# EasyEDA Pro project _天猛星MSPM0电赛1.0_2025-07-10.epro, board PCB3
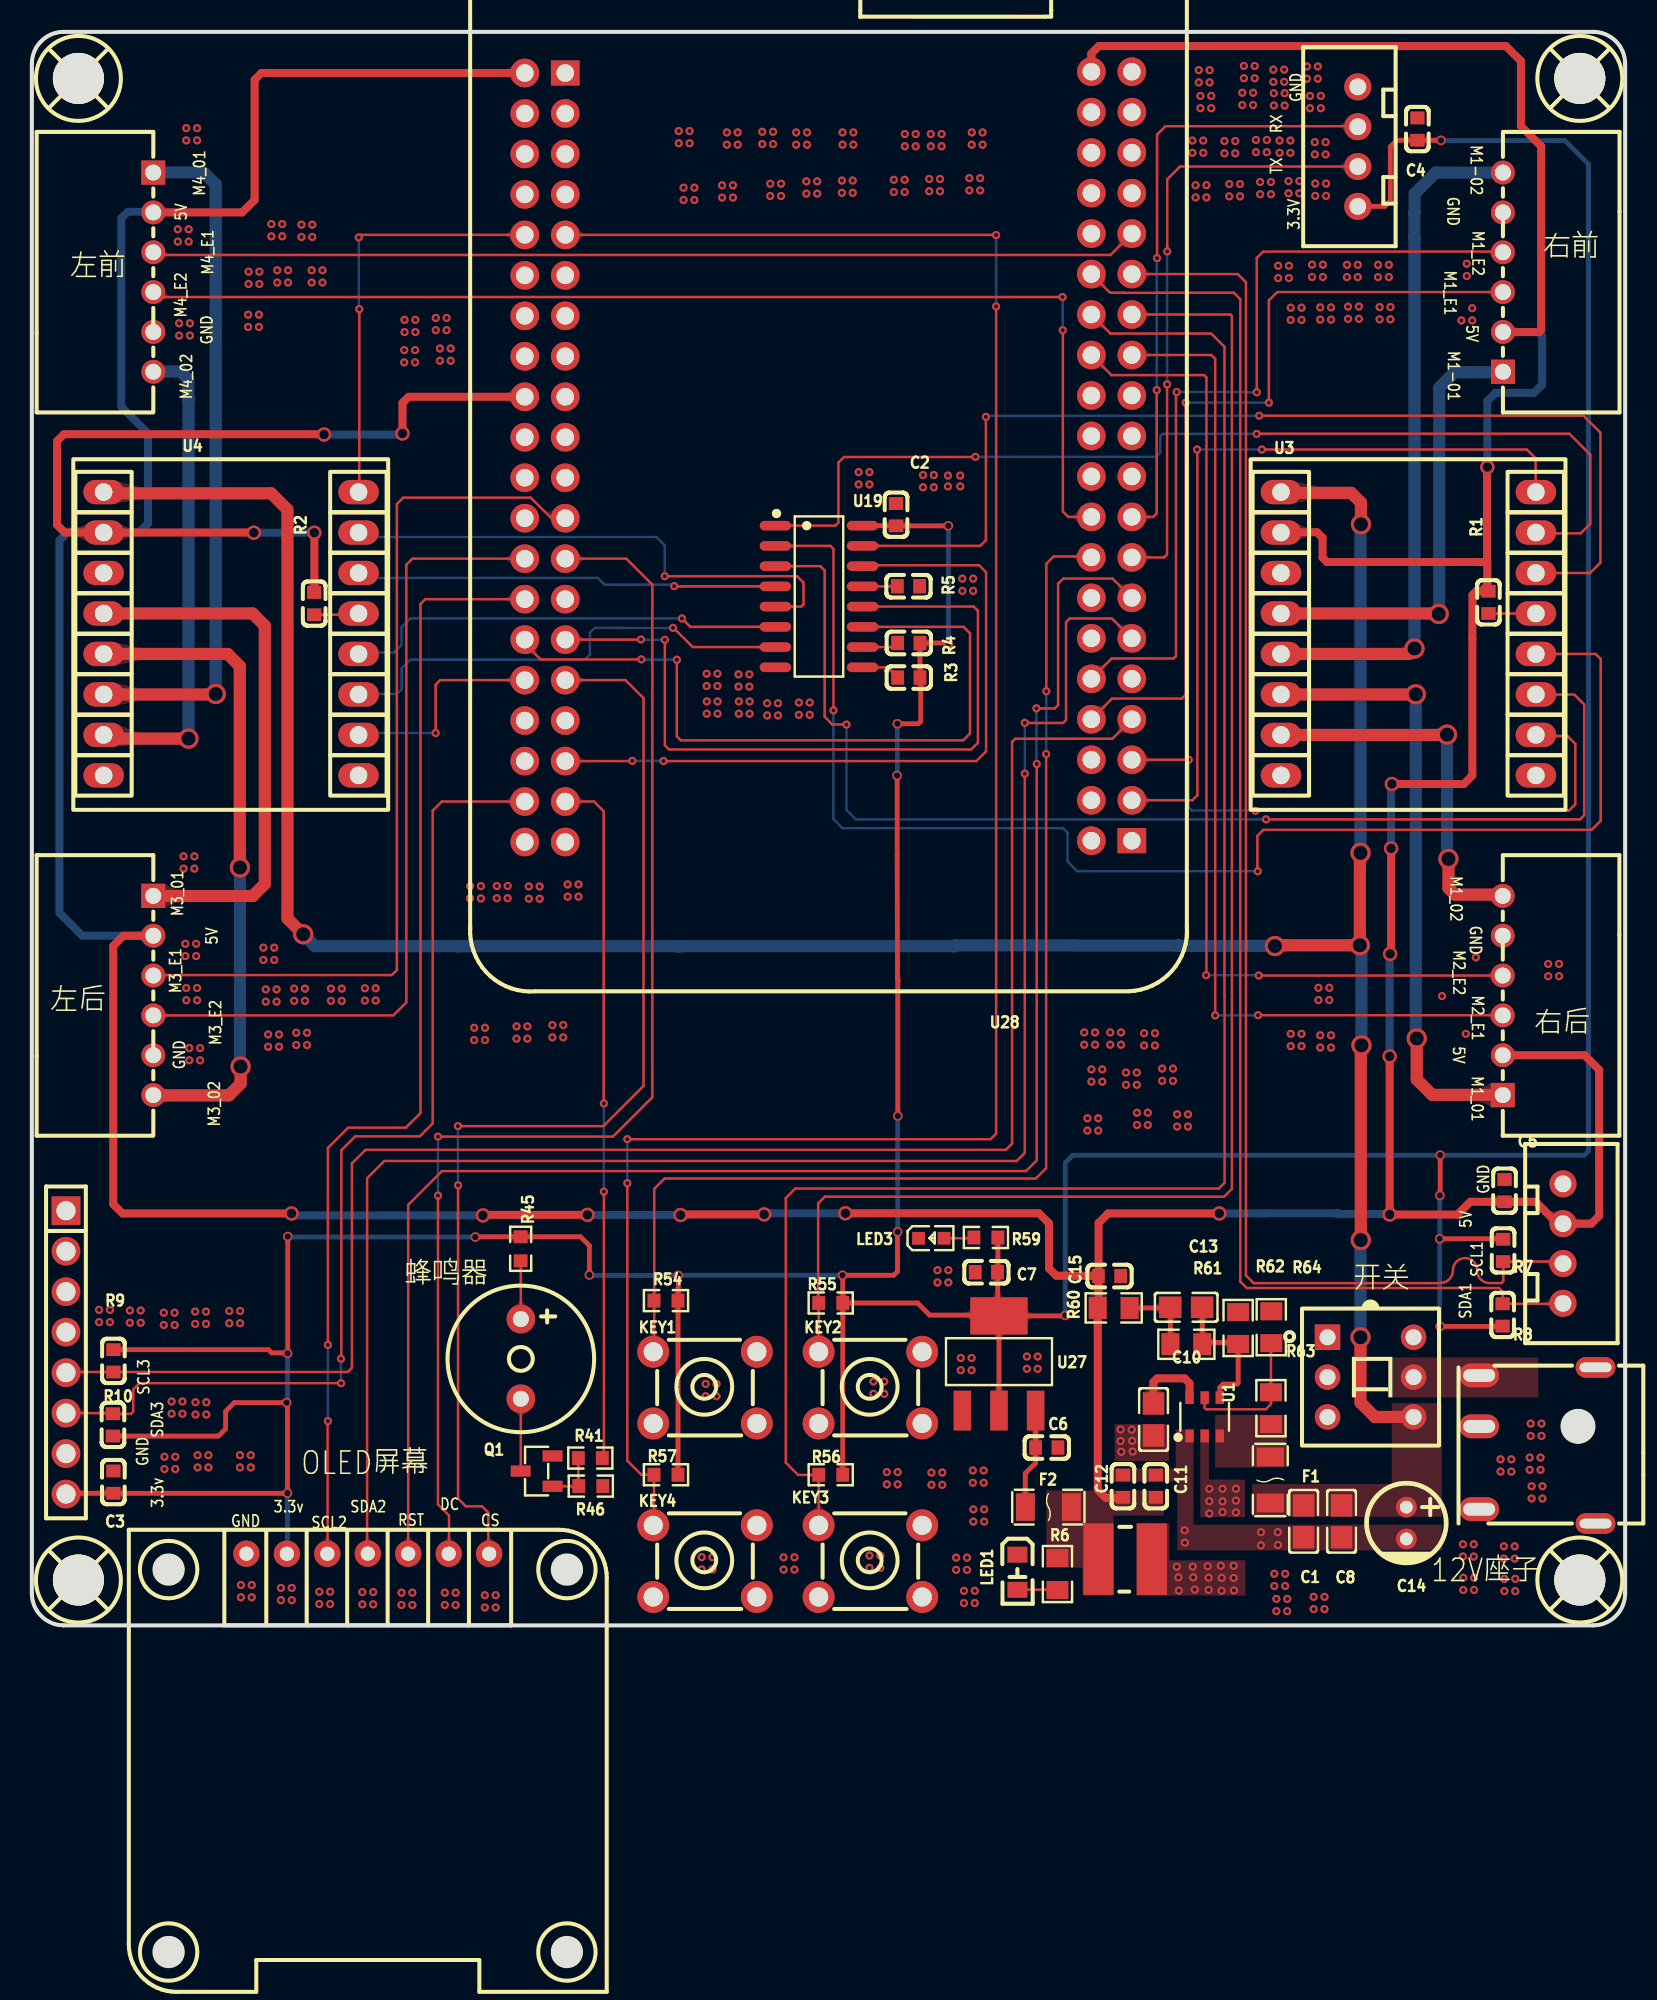
[diagram p3: board, top side]
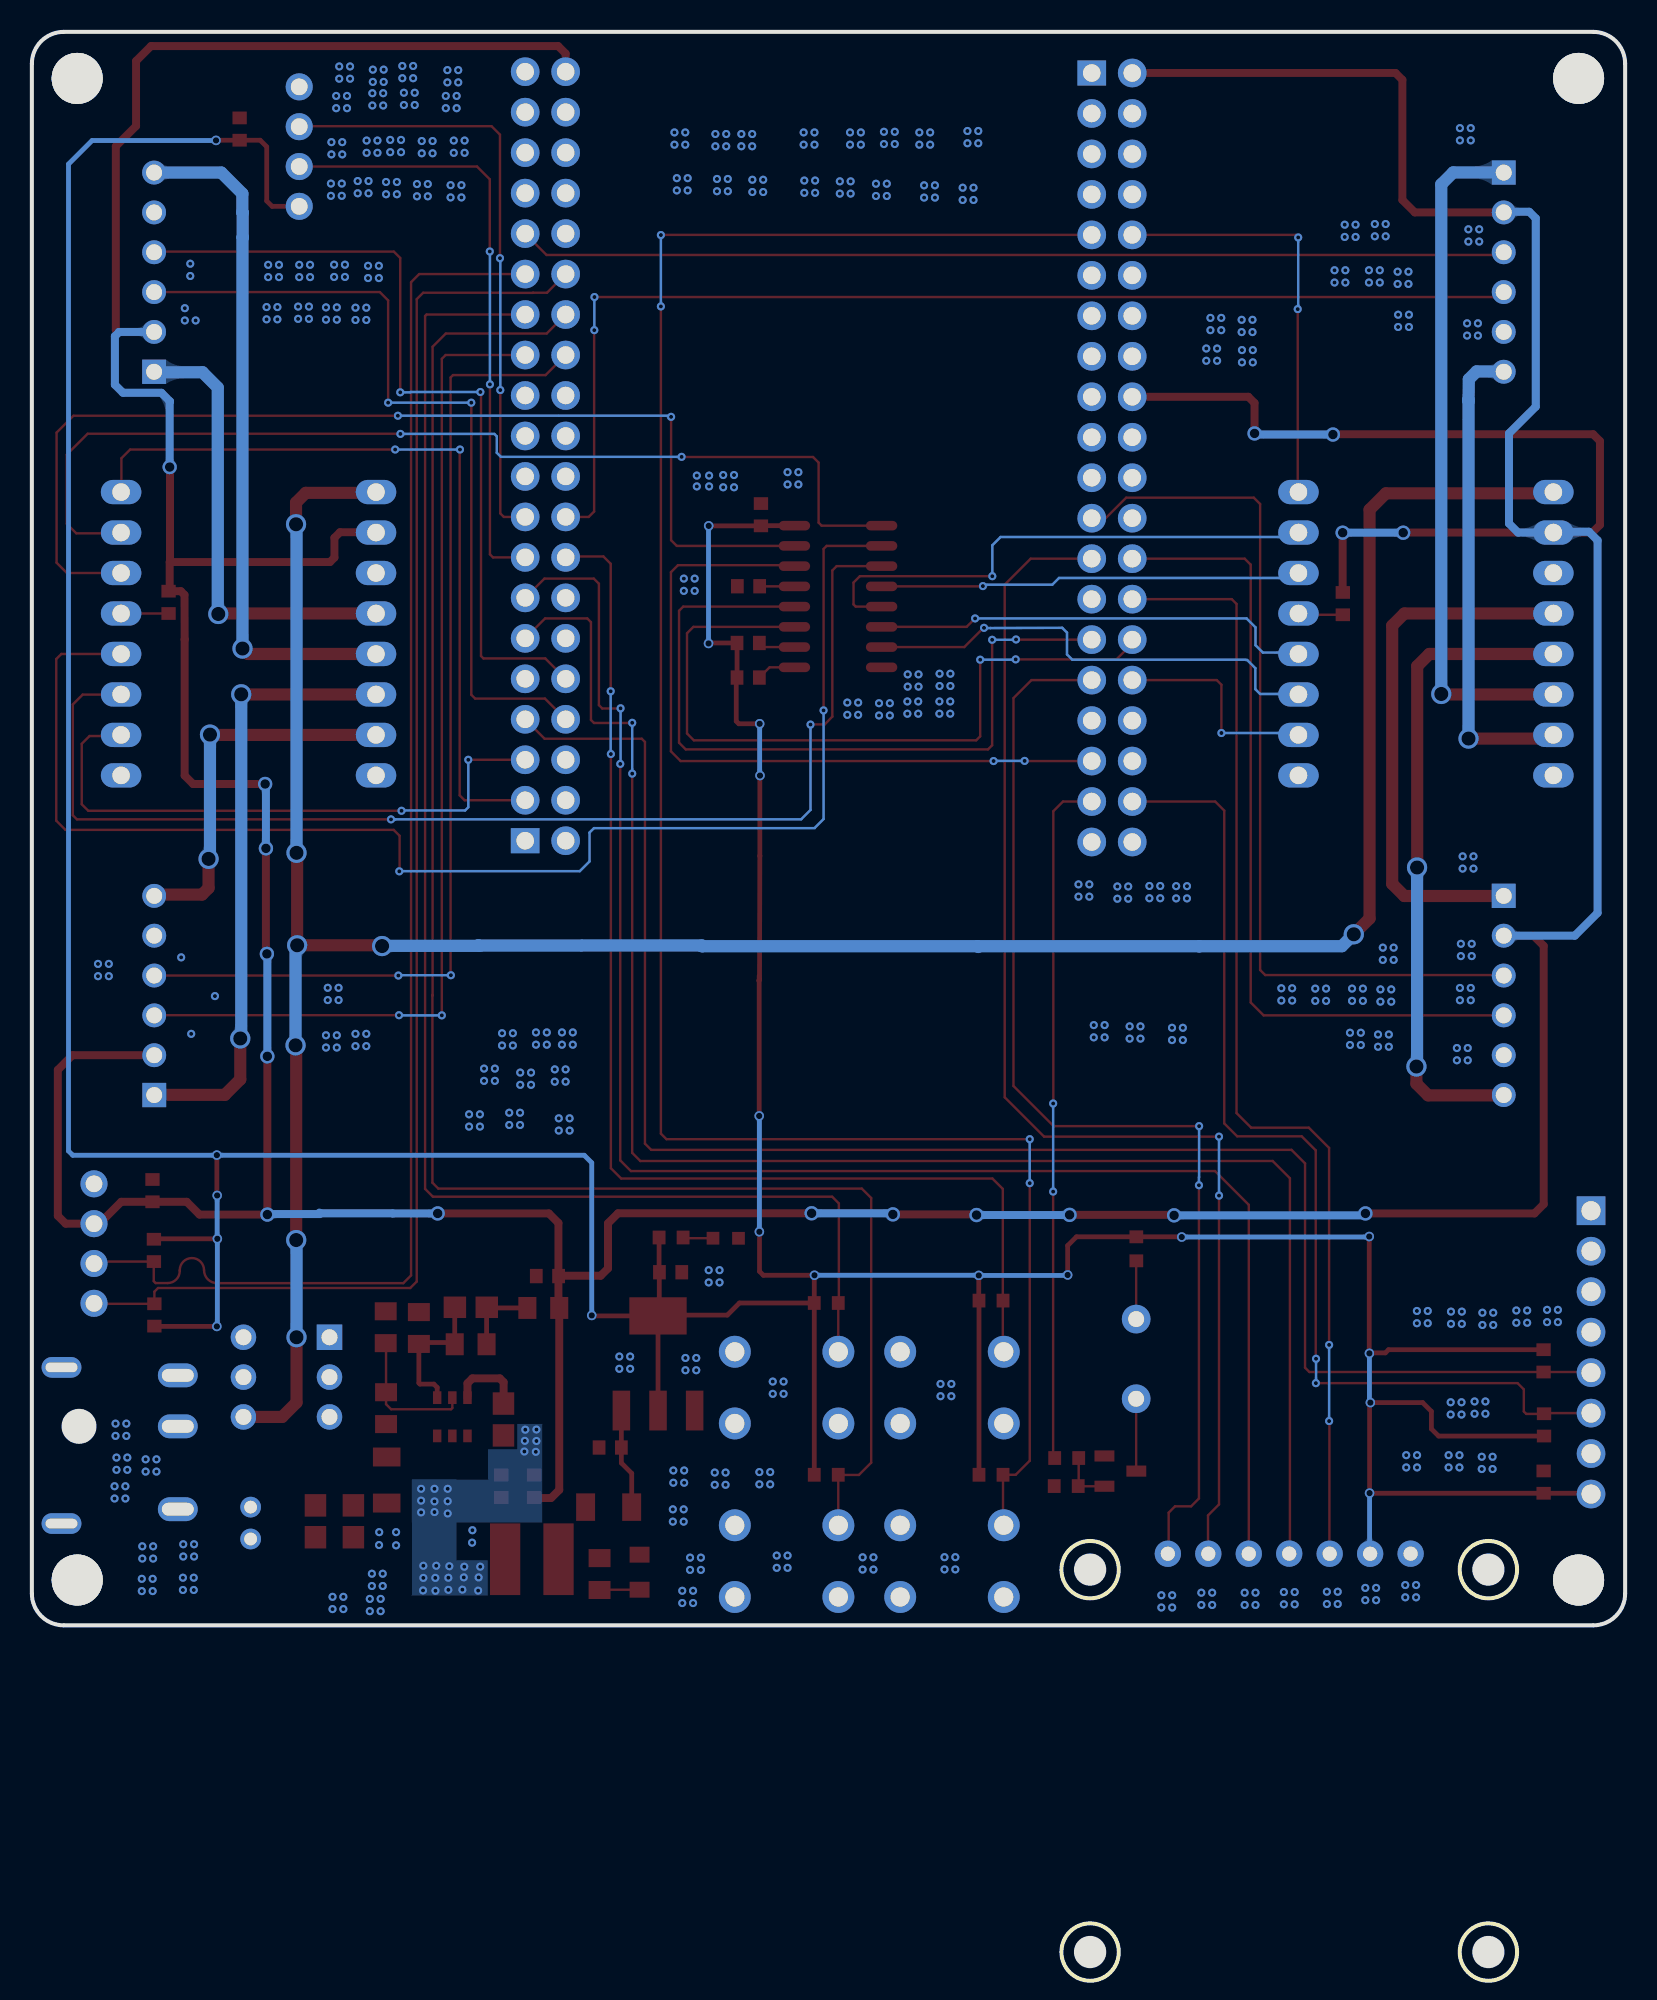
[diagram p4: board, bottom side, seen from below]

Outline 100 x 121.51 mm; copper layers: Top Layer, Bottom Layer. Coordinates in mm from the lower left corner of the outline.
Outline path: 0,119.51 0,23.51 arc(0.59,22.1) 2,21.51 98,21.51 arc(99.41,22.1) 100,23.51 100,119.51 arc(99.41,120.93) 98,121.51 2,121.51 arc(0.59,120.93) 0,119.51
Stack: Top Layer 0.035mm / Dielectric1 1.51mm FR4 er 4.5 / Bottom Layer 0.035mm

## Design rules (mm)
net +3.3V: 3.3v
net 5V: 5v
net SCL1: DP3
net SDA1: DP3
net 12V: 12v
net M2_O2: 12v
net M2_O1: 12v
net M1_O2: 12v
net M1_O1: 12v
net M4_O2: 12v
net M4_O1: 12v
net M3_O2: 12v
net M3_O1: 12v
net FB: 3.3v
net $1N22686: 3.3v
net $1N22679: 5v
net DC12V: 12v
net $1N2097: 3.3v
template: 常用
spacing copperThickness1oz (default): track to track 0.203, other pairs 0.152 to 0.203
spacing copperThickness2oz: track to track 0.203, other pairs 0.152 to 0.3
track width 12: min 0.762, default 0.762, max 0.762
track width 信号线 (default): min 0.152, default 0.152, max 0.152
track width 3v3: min 0.3, default 0.3, max 0.5
track width 5v电源线: min 0.5, default 0.5, max 1
differential pair differentialPair (default): width min 0.152, default 0.152, max 0.152; gap min 0.152, default 0.152
via 信号线孔 (default): diameter min 0.508, default 0.508, max 0.508; hole min 0.254, default 0.254, max 0.305
via 3v3: diameter min 0.4, default 0.6, max 1; hole min 0.4, default 0.4, max 0.6
via 12v: diameter min 0.762, default 1.27, max 2.032; hole min 0.762, default 0.889, max 2.032
via 5v: diameter min 0.75, default 0.9, max 2; hole min 0.6, default 0.6, max 2
net class 3.3v uses 3v3
net class 5v uses 5v, 5v电源线
net class 12v uses 12, 12v
net +3.3V uses 3v3
net 5V uses 5v, 5v电源线
net 12V uses 12, 12v
net M2_O2 uses 12, 12v
net M2_O1 uses 12, 12v
net M1_O2 uses 12, 12v
net M1_O1 uses 12, 12v
net M4_O2 uses 12, 12v
net M4_O1 uses 12, 12v
net M3_O2 uses 12, 12v
net M3_O1 uses 12, 12v
net FB uses 3v3
net $1N22686 uses 3v3
net $1N22679 uses 5v, 5v电源线
net DC12V uses 12, 12v
net $1N2097 uses 3v3

## Placement (name value [footprint] x y rotation side)
BUZZER3  3kHz  [BUZ-TH_BD9.0-P5.00-D0.6-FD]  30.69 38.23 270 top
C1  100nF  [C0805]  79.82 28.04 90 top
C2  100nF  [C0603]  54.24 91.21 90 top
C3  100nF  [C0603]  5.12 30.5 270 top
C4  100nF  [C0603]  86.96 115.41 90 top
C5  100nF  [C0603]  92.43 48.79 270 top
C6  100nF  [C0603]  63.7 32.67 180 top
C7  100nF  [C0603]  59.91 43.67 0 top
C8  10uF  [C0805]  82.2 28.04 90 top
C10  100nF  [C0805]  70.4 34.43 90 top
C11  0.1uF  [C0603]  70.54 30.24 270 top
C12  22uF  [C0603]  68.48 30.24 270 top
C13  75pf  [C0805]  72.45 41.47 180 top
C14  47uF  [CAP-TH_BD5.0-P2.00-D0.8-FD]  86.27 27.93 270 top
C15  22uF  [C0603]  67.64 43.43 180 top
DC1  HX DC044B-2.0 QT  [DC-IN-TH_HX-DC044B-2.0-QT]  94.49 32.8 180 top
F1  nSMD010  [F1206]  77.73 30.63 90 top
F2  nSMD010  [F1206]  63.8 28.93 180 top
H1  -  [HDR-TH_8P-P2.54-V-F-1]  2.14 38.64 270 top
KEY1  按键开关6*6*8  [KEY-TH_4P-L6.0-W6.0-P4.50-LS7.5]  42.25 36.43 0 top
KEY2  按键开关6*6*8  [KEY-TH_4P-L6.0-W6.0-P4.50-LS7.5]  52.63 36.43 0 top
KEY3  按键开关6*6*8  [KEY-TH_4P-L6.0-W6.0-P4.50-LS7.5]  52.63 25.54 0 top
KEY4  按键开关6*6*8  [KEY-TH_4P-L6.0-W6.0-P4.50-LS7.5]  42.25 25.54 0 top
LED1  -  [LED_0805]  61.85 24.8 270 top
LED3  -  [LED_0603]  56.5 45.81 0 top
Q1  AO3400A  [SOT-23-3_L2.9-W1.3-P1.90-LS2.4-BR]  31.68 31.19 0 top
R1  10K  [C0603]  91.42 85.71 90 top
R2  10K  [C0603]  17.72 85.63 90 top
R3  10K  [C0603]  55.04 80.99 0 top
R4  10K  [C0603]  55.04 83.16 0 top
R5  10K  [C0603]  55.02 86.72 0 top
R6  5K  [R0805]  64.37 24.73 90 top
R7  4.7K  [C0603]  92.34 45.04 270 top
R8  4.7K  [C0603]  92.31 40.99 90 top
R9  4.7K  [C0603]  5.12 38.11 270 top
R10  4.7K  [C0603]  5.09 34.09 90 top
R41  22R  [R0603]  35.05 32.01 0 top
R45  100R  [R0603]  30.68 45.14 270 top
R46  10K  [R0603]  35.08 30.25 180 top
R54  10K  [R0603]  39.8 41.89 180 top
R55  10K  [R0603]  50.14 41.74 180 top
R56  10K  [R0603]  50.14 30.96 180 top
R57  10K  [R0603]  39.8 30.96 180 top
R59  2k  [R0603]  59.88 45.85 0 top
R60  49.9  [R0805]  67.9 41.43 180 top
R61  100K  [R0805]  72.46 39.15 180 top
R62  13.3K  [R0805]  75.71 40.17 270 top
R63  511K  [R0805]  77.77 35.14 270 top
R64  105K  [R0805]  77.79 40.22 270 top
SCREW1  -  [M3螺丝]  97.16 118.59 0 top
SCREW2  -  [M3螺丝]  2.92 24.36 0 top
SCREW3  -  [M3螺丝]  2.92 118.59 0 top
SCREW4  -  [M3螺丝]  97.16 24.36 0 top
SW1  XKB8585-Z-150  [SW-TH_6P-L8.5-W8.5-P2.50-LS5.4-BL-1]  84.02 37.09 270 top
U1  TPS54302DDCT  [TSOT-23-6_L2.9-W1.6-P0.95-LS2.8-BR]  73.61 34.6 270 top
U3  -  [TB6612]  76.34 72.64 0 top
U4  -  [TB6612]  2.45 72.64 0 top
U11  OLED_SPI  [0.96OLED_7P]  21.08 26.01 0 top
U18  PCA9555  [CONN-TH_4P-P2.50-XH2.54-4P]  96.1 45.47 90 top
U19  74HC595D,118  [SOIC-16_L9.9-W3.9-P1.27-LS6.0-BL]  49.4 86.08 270 top
U21  UART1  [CONN-TH_4P-P2.50-XH2.54-4P]  83.22 114.31 270 top
U27  A1117-3.3  [SOT-223-3_L6.5-W3.4-P2.30-LS7.0-BR-1]  60.7 37.96 270 top
U28  LCKFB-TMX-MSPM0G3507  [COMM-TH_LCKFB-TMX-MSPM0G3507]  49.99 94.84 180 top
U29  ZX-XH2.54-6PWZ  [CONN-TH_6P-P2.50_ZX-XH2.54-6PWZ]  92.33 106.43 90 top
U30  ZX-XH2.54-6PWZ  [CONN-TH_6P-P2.50_ZX-XH2.54-6PWZ]  92.32 61.04 90 top
U31  ZX-XH2.54-6PWZ  [CONN-TH_6P-P2.50_ZX-XH2.54-6PWZ]  7.62 61.04 270 top
U32  ZX-XH2.54-6PWZ  [CONN-TH_6P-P2.50_ZX-XH2.54-6PWZ]  7.62 106.43 270 top
U33  10uh  [IND-SMD_L4.5-W4.0_SCD0403T]  68.62 25.66 180 top

## Footprints (pads in the part's own frame, mm; a bottom-side part is the same pattern mirrored in y, then rotated)
0.96OLED_7P
  round 1.651 hole 0.889: 1(-7.617,0.003) 2(-5.077,-0.003) 3(-2.538,-0.003) 4(0.003,0.005) 5(2.54,0) 6(5.08,0) 7(7.62,-0.003)
BUZ-TH_BD9.0-P5.00-D0.6-FD
  round 1.8 hole 1: 1(-2.5,0) 2(2.5,0)
C0603
  rect 0.8x0.9 smd: 1(-0.7,0) 2(0.7,0)
C0805
  rect 1.41x1.35 smd: 1(-1,0) 2(1,0)
CAP-TH_BD5.0-P2.00-D0.8-FD
  round 1.3 hole 0.8: 1(-1,0) 2(1,0)
COMM-TH_LCKFB-TMX-MSPM0G3507
  rect 1.8x1.575 hole 1.1: 1(-19.05,24.09) 41(16.51,-24.09)
  round 1.8 hole 1.1: 2(-16.51,24.09) 3(-19.05,21.549) 4(-16.51,21.549) 5(-19.05,19.009) 6(-16.51,19.009) 7(-19.05,16.47) 8(-16.51,16.47) 9(-19.05,13.93) 10(-16.51,13.93) 11(-19.05,11.389) 12(-16.51,11.389) 13(-19.05,8.85) 14(-16.51,8.85) 15(-19.05,6.309) 16(-16.51,6.309) 17(-19.05,3.769) 18(-16.51,3.769) 19(-19.05,1.23) 20(-16.51,1.23) 21(-19.05,-1.31) 22(-16.51,-1.31) 23(-19.05,-3.85) 24(-16.51,-3.85) 25(-19.05,-6.391) 26(-16.51,-6.391) 27(-19.05,-8.931) 28(-16.51,-8.931) 29(-19.05,-11.47) 30(-16.51,-11.47) 31(-19.05,-14.011) 32(-16.51,-14.011) 33(-19.05,-16.55) 34(-16.51,-16.55) 35(-19.05,-19.09) 36(-16.51,-19.09) 37(-19.05,-21.631) 38(-16.51,-21.631) 39(-19.05,-24.171) 40(-16.51,-24.171) 42(19.05,-24.09) 43(16.51,-21.549) 44(19.05,-21.549) 45(16.51,-19.009) 46(19.05,-19.009) 47(16.51,-16.47) 48(19.05,-16.47) 49(16.51,-13.93) 50(19.05,-13.93) 51(16.51,-11.389) 52(19.05,-11.389) 53(16.51,-8.85) 54(19.05,-8.85) 55(16.51,-6.309) 56(19.05,-6.309) 57(16.51,-3.769) 58(19.05,-3.769) 59(16.51,-1.23) 60(19.05,-1.23) 61(16.51,1.31) 62(19.05,1.31) 63(16.51,3.85) 64(19.05,3.85) 65(16.51,6.391) 66(19.05,6.391) 67(16.51,8.931) 68(19.05,8.931) 69(16.51,11.47) 70(19.05,11.47) 71(16.51,14.011) 72(19.05,14.011) 73(16.51,16.55) 74(19.05,16.55) 75(16.51,19.09) 76(19.05,19.09) 77(16.51,21.631) 78(19.05,21.631) 79(16.51,24.171) 80(19.05,24.171)
CONN-TH_4P-P2.50-XH2.54-4P
  round 1.7 hole 1.05: 1(3.75,0) 2(1.25,0) 3(-1.25,0) 4(-3.75,0)
CONN-TH_6P-P2.50_ZX-XH2.54-6PWZ
  rect 1.524x1.5 hole 1: 1(-6.25,0)
  round 1.5 hole 1: 2(-3.75,0) 3(-1.25,0) 4(1.25,0) 5(3.75,0) 6(6.25,0)
DC-IN-TH_HX-DC044B-2.0-QT
  oval 2.5x1.3 hole 2x0.6: 1(-3.65,4.9) 1(-3.65,-4.9)
  oval 2.5x1.5 hole 2x0.8: 2(3.65,4) 3(3.65,-1.2) 4(3.65,-4.4)
F1206
  rect 1.19x1.728 smd: 1(-1.445,0) 2(1.445,0)
HDR-TH_8P-P2.54-V-F-1
  rect 1.8x1.8 hole 1.2: 1(-8.89,0)
  round 1.8 hole 1.2: 2(-6.35,0) 3(-3.81,0) 4(-1.27,0) 5(1.27,0) 6(3.81,0) 7(6.35,0) 8(8.89,0)
IND-SMD_L4.5-W4.0_SCD0403T
  rect 1.9x4.5 smd: 1(-1.675,0) 2(1.675,0)
KEY-TH_4P-L6.0-W6.0-P4.50-LS7.5
  round 2 hole 1.2: 1(-3.25,-2.25) 2(3.25,-2.25) 3(3.25,2.25) 4(-3.25,2.25)
LED_0603
  rect 0.8x0.8 smd: 1(-0.851,-0.01) 2(0.75,-0.005)
LED_0805
  rect 1x1.25 smd: 1(-1.15,0.005) 2(1.05,0.005)
M3螺丝
  round 3.2 hole 3.2: 1(0,0)
R0603
  rect 0.806x0.864 smd: 1(-0.753,0) 2(0.753,0)
R0805
  rect 1.133x1.377 smd: 1(-1,0) 2(1,0)
SOIC-16_L9.9-W3.9-P1.27-LS6.0-BL
  oval 0.602x1.971 smd: 1(-4.445,-2.736) 2(-3.175,-2.736) 3(-1.905,-2.736) 4(-0.635,-2.736) 5(0.635,-2.736) 6(1.905,-2.736) 7(3.175,-2.736) 8(4.445,-2.736) 9(4.445,2.736) 10(3.175,2.736) 11(1.905,2.736) 12(0.635,2.736) 13(-0.635,2.736) 14(-1.905,2.736) 15(-3.175,2.736) 16(-4.445,2.736)
SOT-23-3_L2.9-W1.3-P1.90-LS2.4-BR
  rect 1.25x0.7 smd: 1(1,-0.95) 2(1,0.95) 3(-1,0)
SOT-223-3_L6.5-W3.4-P2.30-LS7.0-BR-1
  rect 2.5x1.1 smd: 1(2.97,-2.3) 2(2.97,0) 3(2.97,2.3)
  rect 2.34x3.6 smd: 2(-2.97,0)
SW-TH_6P-L8.5-W8.5-P2.50-LS5.4-BL-1
  rect 1.6x1.6 hole 1: 1(-2.5,-2.7)
  round 1.6 hole 1: 2(0,-2.7) 3(2.5,-2.7) 4(2.5,2.7) 5(0.001,2.7) 6(-2.5,2.7)
TB6612
  oval 2.54x1.524 hole 1.1: 1(2.057,19.988) 2(2.057,17.448) 3(2.057,14.908) 4(2.057,12.368) 5(2.057,9.828) 6(2.057,7.288) 7(2.057,4.748) 8(2.057,2.208) 9(18.057,2.208) 10(18.057,4.748) 11(18.057,7.288) 12(18.057,9.828) 13(18.057,12.368) 14(18.057,14.908) 15(18.057,17.448) 16(18.057,19.988)
TSOT-23-6_L2.9-W1.6-P0.95-LS2.8-BR
  rect 0.8x0.532 smd: 1(1.2,-0.95) 2(1.2,0) 3(1.2,0.95) 4(-1.2,0.95) 5(-1.2,0) 6(-1.2,-0.95)

## Nets
As in the schematic.

Pads without a net: H1 1 2 3 4; KEY1 2 3; KEY2 2 3; KEY3 2 3; KEY4 2 3; SCREW1 1; SCREW2 1; SCREW3 1; SCREW4 1; SW1 1 2 3 6; U28 1 4 6 9 12 14 19 20 21 22 23 24 32 33 34 35 36 38 41 43 44 45 46 47 48 51 52 53 54 55 56 57 59 60 61 62 64 67 73 74 76

## Via types
v1: diameter 0.508, hole 0.254, Top Layer to Bottom Layer, 655 vias
v2: diameter 0.6, hole 0.4, Top Layer to Bottom Layer, 20 vias
v3: diameter 0.9, hole 0.6, Top Layer to Bottom Layer, 17 vias
v4: diameter 1.27, hole 0.889, Top Layer to Bottom Layer, 18 vias

## Routing (per net, layer and track width the routed paths; a pad name or vN(x,y) marks a point on that pad's centre or on a via; arc(x,y) is an arc through that point)
5V: length 427
  Top Layer w0.5: 90.41,83.38 90.41,83.39 ; 90.41,83.38 90.42,86.18 90.65,86.41 91.35,86.41 ; 90.41,83.38 90.41,74.84 89.88,74.31 v3(85.36,74.31) ; 66.95,43.45 66.95,46.76 67.55,47.36 v3(74.53,47.36) ; 66.95,43.45 64.3,43.45 63.84,43.91 63.84,46.74 63.21,47.37 v3(51.06,47.37) ; 66.95,43.45 66.95,41.48 R60.2 66.9,30.01 67.39,29.52 ; U30.2 97.45,57.29 98.37,56.37 98.37,47.21 97.88,46.72 U18.2 95.76,46.72 94.39,48.09 C5.2 90.28,48.09 89.48,47.29 v3(85.22,47.29) v3(85.22,57.22) ; v3(28.31,47.24) 28.34,47.27 v3(34.87,47.27) ; U29.2 92.34,102.67 94.6,102.67 94.73,102.8 94.73,114.33 93.46,115.6 93.46,119.68 92.52,120.62 66.97,120.62 66.5,120.15 U28.40 ; v3(40.71,47.26) 40.75,47.3 v3(45.96,47.3) ; U32.2 13.2,110.18 13.98,110.96 13.98,118.5 14.41,118.93 U28.42 ; 91.33,88.24 91.33,94.18 v3(91.35,94.2) ; 91.33,88.24 91.35,88.24 91.35,86.41 ; 91.33,88.24 91.33,88.16 ; 91.33,88.24 81.29,88.24 81.01,88.52 81.01,89.76 80.66,90.11 78.42,90.11 U3.2 ; v3(23.26,96.31) 23.26,98.22 23.65,98.61 U28.58 ; v3(16.3,47.36) 5.69,47.36 5.11,47.94 5.11,64.15 5.75,64.79 U31.2 ; 91.35,86.41 R1.2 ; v3(18.34,96.24) 18.32,96.26 2.01,96.26 1.58,95.83 1.58,90.57 2.06,90.09 U4.2 13.92,90.09 v3(13.93,90.08) ; v3(85.25,63.65) 85.31,63.71 v3(85.31,70.27) ; R2.2 17.73,86.34 v3(17.73,90.08) ; C12.2 68.44,29.5 67.42,29.5
  Bottom Layer w0.5: v3(51.06,47.37) 46.03,47.37 v3(45.96,47.3) ; v3(18.34,96.24) 23.19,96.24 v3(23.26,96.31) ; v3(40.71,47.26) 34.84,47.26 34.82,47.24 ; U32.2 7.58,110.22 6.02,110.22 5.61,109.81 5.61,97.99 7.29,96.31 7.29,90.66 6.72,90.09 U4.2 4.45,90.14 2.27,90.14 1.73,89.6 1.73,66.22 3.16,64.79 U31.2 ; v3(28.31,47.24) 16.42,47.24 v3(16.3,47.36) ; 81.95,47.41 81.91,47.37 77.44,47.37 ; v3(85.31,70.27) 85.31,74.26 v3(85.36,74.31) ; v3(85.22,57.22) 85.22,63.62 v3(85.25,63.65) ; 77.34,47.35 77.33,47.36 v3(74.53,47.36) ; 81.91,47.32 85.19,47.32 v3(85.22,47.29) ; v3(13.93,90.08) v3(17.73,90.08) ; v3(91.35,94.2) 91.35,98.3 91.33,98.32 91.87,98.86 94.28,98.86 94.79,99.37 94.79,102.41 94.52,102.68 U29.2
12V: length 171.5
  Top Layer w0.762: v4(83.42,90.61) 83.42,91.97 82.81,92.58 78.45,92.58 U3.1 ; v4(83.39,69.99) 83.35,69.95 v4(83.35,64.19) 78.07,64.19 v4(78.02,64.14) ; SW1.4 84.29,34.59 83.39,35.49 v4(83.39,39.59) ; v4(83.45,57.91) 83.41,57.87 v4(83.41,45.69) ; U4.1 4.58,92.55 15.02,92.55 16.04,91.53 16.04,65.87 v4(17.03,64.88)
  Bottom Layer w0.762: v4(78.02,64.14) 78.01,64.15 71.88,64.15 ; 57.9,64.13 40.65,64.13 ; 57.9,64.13 57.95,64.18 65.47,64.18 ; 57.9,64.13 57.98,64.13 ; 40.65,64.13 26.74,64.13 ; 40.65,64.13 40.6,64.08 ; 26.74,64.13 17.78,64.13 v4(17.03,64.88) ; 26.74,64.13 26.72,64.11 ; v4(83.41,45.69) 83.39,45.67 v4(83.39,39.59) ; 71.98,64.2 71.95,64.17 65.52,64.17 ; v4(83.45,57.91) 83.45,64.09 v4(83.35,64.19) ; v4(83.39,69.99) 83.39,90.58 v4(83.42,90.61)
+3.3V: length 346.1
  Top Layer w0.3: v2(64.86,40.96) 64.83,40.93 U27.2 ; 54.31,69.8 54.31,74.83 v2(54.3,74.84) ; 54.31,69.8 54.31,69.78 ; 54.31,69.8 54.33,62.02 54.35,62 ; 54.35,62 54.38,61.97 ; 54.35,62 54.35,62.27 ; 54.35,62 v2(54.35,53.48) ; v2(34.99,43.5) 34.99,45.34 34.44,45.89 R45.1 27.84,45.89 v2(27.83,45.88) ; H1.8 2.19,29.8 C3.2 16.03,29.8 v2(16.04,29.81) 16.04,35.44 v2(15.99,35.49) 12.71,35.49 12.16,34.94 12.16,33.84 11.71,33.39 R10.1 ; R55.1 55.59,41.74 56.35,40.98 60.65,40.98 ; R55.1 50.89,43.47 v2(50.88,43.48) 54.09,43.48 54.33,43.72 54.33,46.2 v2(54.34,46.21) ; R55.1 R56.1 ; 57.57,90.49 57.55,90.51 v2(57.52,90.51) C2.1 54.23,90.52 U19.16 ; R7.1 92.31,45.77 v2(88.36,45.77) ; 60.62,43.81 60.62,43.68 ; 60.62,43.68 60.63,43.69 60.63,45.85 ; 60.62,43.68 60.62,41.01 60.65,40.98 ; 60.62,43.68 C7.2 ; v2(54.32,78.09) 55.63,78.09 55.79,78.25 55.79,80.94 R3.2 R4.2 57.5,83.16 v2(57.53,83.13) ; U27.2 60.65,40.98 ; U27.2 U27.2 ; U21.1 84.92,110.56 85.26,110.9 85.26,114.3 85.67,114.71 C4.1 88.43,114.71 ; R57.1 R54.1 40.57,41.91 v2(40.57,43.47) ; v2(88.39,40.27) 92.29,40.27 R8.1 ; v2(88.37,48.49) 88.39,48.51 v2(88.39,51.02) ; v2(16.06,45.91) 16.06,38.59 v2(16.05,38.58) 16.02,38.61 15.05,38.61 14.85,38.81 R9.1
  Bottom Layer w0.3: v2(54.35,53.48) 54.34,53.47 v2(54.34,46.21) ; v2(34.99,43.5) 35.02,43.47 v2(40.57,43.47) 40.58,43.48 v2(50.88,43.48) ; v2(16.05,38.58) 16.05,35.55 v2(15.99,35.49) ; v2(54.32,78.09) 54.32,74.86 v2(54.3,74.84) ; v2(27.83,45.88) 16.09,45.88 v2(16.06,45.91) ; v2(88.39,40.27) 88.36,40.3 v2(88.36,45.77) 88.37,45.78 v2(88.37,48.49) ; v2(57.53,83.13) 57.53,90.5 v2(57.52,90.51) ; U11.2 16.04,26.04 v2(16.04,29.81) ; 88.45,114.69 96.22,114.69 97.7,113.21 97.7,51.28 97.43,51.01 65.33,51.01 64.86,50.54 v2(64.86,40.96)
  vias: v2(88.44,114.7)
GND:
  vias: v1(4.22,41.31) v1(4.22,40.54) v1(4.9,41.31) v1(4.9,40.54) v1(6.15,41.27) v1(6.15,40.5) v1(6.83,41.27) v1(6.83,40.5) v1(8.28,41.13) v1(8.28,40.36) v1(8.32,32.09) v1(8.32,31.32) v1(8.77,35.56) v1(8.77,34.79) v1(8.96,41.13) v1(8.96,40.36) v1(9,32.09) v1(9,31.32) v1(9.16,109.12) v1(9.16,108.35) v1(9.24,103.22) v1(9.24,102.45) v1(9.52,69.77) v1(9.52,69) v1(9.45,35.56) v1(9.45,34.79) v1(9.63,64.28) v1(9.63,63.51) v1(9.69,115.47) v1(9.69,114.7) v1(9.69,61.51) v1(9.69,60.74) v1(9.84,109.12) v1(9.84,108.35) v1(9.92,103.22) v1(9.92,102.45) v1(9.88,57.74) v1(9.88,56.97) v1(10.2,69.77) v1(10.2,69) v1(10.25,41.2) v1(10.25,40.43) v1(10.31,64.28) v1(10.31,63.51) v1(10.27,35.51) v1(10.27,34.74) v1(10.37,115.47) v1(10.37,114.7) v1(10.37,61.51) v1(10.37,60.74) v1(10.4,32.19) v1(10.4,31.42) v1(10.56,57.74) v1(10.56,56.97) v1(10.93,41.2) v1(10.93,40.43) v1(10.95,35.51) v1(10.95,34.74) v1(11.08,32.19) v1(11.08,31.42) v1(12.39,41.24) v1(12.39,40.47) v1(13.07,41.24) v1(13.07,40.47) v1(13.06,32.19) v1(13.06,31.42) v1(13.12,24.04) v1(13.12,23.27) v1(13.6,106.46) v1(13.6,105.69) v1(13.57,103.76) v1(13.57,102.99) v1(13.74,32.19) v1(13.74,31.42) v1(13.8,24.04) v1(13.8,23.27) v1(14.25,103.76) v1(14.25,102.99) v1(14.28,106.46) v1(14.28,105.69) v1(14.53,64.04) v1(14.53,63.27) v1(14.68,61.42) v1(14.68,60.65) v1(14.83,58.59) v1(14.83,57.82) v1(15.03,109.45) v1(15.03,108.68) v1(15.21,64.04) v1(15.21,63.27) v1(15.4,106.55) v1(15.4,105.78) v1(15.36,61.42) v1(15.36,60.65) v1(15.51,58.59) v1(15.51,57.82) v1(15.63,23.86) v1(15.63,23.09) v1(15.71,109.45) v1(15.71,108.68) v1(16.08,106.55) v1(16.08,105.78) v1(16.31,23.86) v1(16.31,23.09) v1(16.46,61.47) v1(16.46,60.7) v1(16.59,58.7) v1(16.59,57.93) v1(16.92,109.41) v1(16.92,108.64) v1(17.14,61.47) v1(17.14,60.7) v1(17.27,58.7) v1(17.27,57.93) v1(17.6,109.41) v1(17.6,108.64) v1(17.56,106.55) v1(17.56,105.78) v1(18.04,23.62) v1(18.04,22.85) v1(18.24,106.55) v1(18.24,105.78) v1(18.72,23.62) v1(18.72,22.85) v1(18.77,61.47) v1(18.77,60.7) v1(19.45,61.47) v1(19.45,60.7) v1(20.74,23.6) v1(20.74,22.83) v1(20.9,61.49) v1(20.9,60.72) v1(21.42,23.6) v1(21.42,22.83) v1(21.58,61.49) v1(21.58,60.72) v1(23.2,23.56) v1(23.2,22.79) v1(23.39,103.44) v1(23.39,102.67) v1(23.37,101.54) v1(23.37,100.77) v1(23.88,23.56) v1(23.88,22.79) v1(24.05,101.54) v1(24.05,100.77) v1(24.07,103.44) v1(24.07,102.67) v1(25.35,103.56) v1(25.35,102.79) v1(25.61,101.64) v1(25.61,100.87) v1(25.92,23.56) v1(25.92,22.79) v1(26.03,103.56) v1(26.03,102.79) v1(26.29,101.64) v1(26.29,100.87) v1(26.6,23.56) v1(26.6,22.79) v1(27.5,67.9) v1(27.5,67.13) v1(27.76,59.01) v1(27.76,58.24) v1(28.18,67.9) v1(28.18,67.13) v1(28.44,59.01) v1(28.44,58.24) v1(28.43,23.4) v1(28.43,22.63) v1(29.11,23.4) v1(29.11,22.63) v1(29.18,67.91) v1(29.18,67.14) v1(29.86,67.91) v1(29.86,67.14) v1(30.42,59.1) v1(30.42,58.33) v1(31.1,59.1) v1(31.1,58.33) v1(31.19,67.88) v1(31.19,67.11) v1(31.87,67.88) v1(31.87,67.11) v1(32.67,59.18) v1(32.67,58.41) v1(33.35,59.18) v1(33.35,58.41) v1(33.63,68.01) v1(33.63,67.24) v1(34.31,68.01) v1(34.31,67.24) v1(40.6,115.29) v1(40.6,114.52) v1(40.9,111.73) v1(40.9,110.96) v1(41.28,115.29) v1(41.28,114.52) v1(41.58,111.73) v1(41.58,110.96) v1(42.04,25.79) v1(42.04,25.02) v1(42.35,81.23) v1(42.35,80.46) v1(42.29,36.66) v1(42.29,35.89) v1(42.36,79.49) v1(42.36,78.72) v1(42.72,25.79) v1(42.72,25.02) v1(43.03,81.23) v1(43.03,80.46) v1(43.04,79.49) v1(43.04,78.72) v1(42.97,36.66) v1(42.97,35.89) v1(43.32,111.88) v1(43.32,111.11) v1(43.62,115.2) v1(43.62,114.43) v1(44,111.88) v1(44,111.11) v1(44.3,115.2) v1(44.3,114.43) v1(44.35,81.19) v1(44.35,80.42) v1(44.37,79.49) v1(44.37,78.72) v1(45.03,81.19) v1(45.03,80.42) v1(45.05,79.49) v1(45.05,78.72) v1(45.84,115.24) v1(45.84,114.47) v1(46.15,79.38) v1(46.15,78.61) v1(46.34,111.98) v1(46.34,111.21) v1(46.52,115.24) v1(46.52,114.47) v1(46.83,79.38) v1(46.83,78.61) v1(47.02,111.98) v1(47.02,111.21) v1(47.18,25.78) v1(47.18,25.01) v1(47.86,25.78) v1(47.86,25.01) v1(47.97,115.2) v1(47.97,114.43) v1(48.14,79.42) v1(48.14,78.65) v1(48.61,112.13) v1(48.61,111.36) v1(48.65,115.2) v1(48.65,114.43) v1(48.82,79.42) v1(48.82,78.65) v1(49.29,112.13) v1(49.29,111.36) v1(50.84,112.18) v1(50.84,111.41) v1(50.88,115.2) v1(50.88,114.43) v1(51.52,112.18) v1(51.52,111.41) v1(51.56,115.2) v1(51.56,114.43) v1(51.89,93.88) v1(51.89,93.11) v1(52.57,93.88) v1(52.57,93.11) v1(52.57,25.89) v1(52.57,25.12) v1(52.82,36.81) v1(52.82,36.04) v1(53.25,25.89) v1(53.25,25.12) v1(53.5,36.81) v1(53.5,36.04) v1(53.66,31.13) v1(53.66,30.36) v1(54.1,112.23) v1(54.1,111.46) v1(54.34,31.13) v1(54.34,30.36) v1(54.79,115.1) v1(54.79,114.33) v1(54.78,112.23) v1(54.78,111.46) v1(55.47,115.1) v1(55.47,114.33) v1(55.93,93.7) v1(55.93,92.93) v1(56.32,112.28) v1(56.32,111.51) v1(56.42,115.1) v1(56.42,114.33) v1(56.46,31.1) v1(56.46,30.33) v1(56.61,93.7) v1(56.61,92.93) v1(56.84,43.8) v1(56.84,43.03) v1(57,112.28) v1(57,111.51) v1(57.1,115.1) v1(57.1,114.33) v1(57.14,31.1) v1(57.14,30.33) v1(57.5,93.67) v1(57.5,92.99) v1(57.52,43.8) v1(57.52,43.03) v1(58.01,25.76) v1(58.01,24.99) v1(58.26,93.67) v1(58.26,92.99) v1(58.3,38.29) v1(58.3,37.52) v1(58.4,87.2) v1(58.4,86.43) v1(58.5,23.68) v1(58.5,22.91) v1(58.69,25.76) v1(58.69,24.99) v1(58.84,112.33) v1(58.84,111.56) v1(58.99,115.2) v1(58.99,114.43) v1(58.98,38.29) v1(58.98,37.52) v1(59.08,87.2) v1(59.08,86.43) v1(59.06,31.23) v1(59.06,30.46) v1(59.09,28.79) v1(59.09,28.02) v1(59.18,23.68) v1(59.18,22.91) v1(59.52,112.33) v1(59.52,111.56) v1(59.67,115.2) v1(59.67,114.43) v1(59.74,31.23) v1(59.74,30.46) v1(59.77,28.79) v1(59.77,28.02) v1(62.45,38.38) v1(62.45,37.61) v1(63.13,38.38) v1(63.13,37.61) v1(66.05,58.72) v1(66.05,57.95) v1(66.25,53.33) v1(66.25,52.56) v1(66.5,56.4) v1(66.5,55.63) v1(66.73,58.72) v1(66.73,57.95) v1(66.93,53.33) v1(66.93,52.56) v1(67.18,56.4) v1(67.18,55.63) v1(67.68,58.72) v1(67.68,57.95) v1(68.36,58.72) v1(68.36,57.95) v1(68.67,56.2) v1(68.67,55.43) v1(69.35,56.2) v1(69.35,55.43) v1(69.36,53.68) v1(69.36,52.91) v1(69.81,58.67) v1(69.81,57.9) v1(70.04,53.68) v1(70.04,52.91) v1(70.49,58.67) v1(70.49,57.9) v1(70.94,56.45) v1(70.94,55.68) v1(71.62,56.45) v1(71.62,55.68) v1(71.88,53.58) v1(71.88,52.81) v1(72.35,27.48) v1(72.37,26.7) v1(72.56,53.58) v1(72.56,52.81) v1(72.84,114.69) v1(72.84,113.92) v1(73.04,111.89) v1(73.04,111.12) v1(73.24,119.11) v1(73.24,118.34) v1(73.34,117.49) v1(73.34,116.72) v1(73.52,114.69) v1(73.52,113.92) v1(73.72,111.89) v1(73.72,111.12) v1(73.92,119.11) v1(73.92,118.34) v1(74.02,117.49) v1(74.02,116.72) v1(74.85,114.66) v1(74.85,113.89) v1(75.15,111.96) v1(75.15,111.19) v1(75.53,114.66) v1(75.53,113.89) v1(75.83,111.96) v1(75.83,111.19) v1(75.97,117.69) v1(75.97,116.92) v1(76.07,119.37) v1(76.07,118.6) v1(76.65,117.69) v1(76.65,116.92) v1(76.75,119.37) v1(76.75,118.6) v1(76.83,114.73) v1(76.83,113.96) v1(77.09,112.09) v1(77.09,111.32) v1(77.14,27.36) v1(77.14,26.53) v1(77.51,114.73) v1(77.51,113.96) v1(77.77,112.09) v1(77.77,111.32) v1(77.92,119.14) v1(77.92,118.37) v1(77.95,117.66) v1(77.95,116.89) v1(77.98,24.75) v1(77.98,23.98) v1(78.11,23.17) v1(78.11,22.4) v1(78.22,106.83) v1(78.22,106.06) v1(78.2,27.36) v1(78.21,26.55) v1(78.31,114.69) v1(78.31,113.92) v1(78.6,119.14) v1(78.6,118.37) v1(78.63,117.66) v1(78.63,116.89) v1(78.66,24.75) v1(78.66,23.98) v1(78.79,23.17) v1(78.79,22.4) v1(78.87,112.15) v1(78.87,111.38) v1(78.9,106.83) v1(78.9,106.06) v1(78.99,114.69) v1(78.99,113.92) v1(79.01,104.2) v1(79.01,103.43) v1(79.01,58.63) v1(79.01,57.86) v1(79.55,112.15) v1(79.55,111.38) v1(79.69,104.2) v1(79.69,103.43) v1(79.69,58.63) v1(79.69,57.86) v1(80.03,119.34) v1(80.03,118.57) v1(80.22,117.49) v1(80.22,116.72) v1(80.35,106.9) v1(80.35,106.13) v1(80.45,23.3) v1(80.45,22.53) v1(80.52,114.59) v1(80.52,113.82) v1(80.55,111.99) v1(80.55,111.22) v1(80.71,119.34) v1(80.71,118.57) v1(80.75,61.52) v1(80.75,60.75) v1(80.9,117.49) v1(80.9,116.72) v1(80.86,104.22) v1(80.86,103.45) v1(80.86,58.54) v1(80.86,57.77) v1(81.03,106.9) v1(81.03,106.13) v1(81.13,23.3) v1(81.13,22.53) v1(81.2,114.59) v1(81.2,113.82) v1(81.23,111.99) v1(81.23,111.22) v1(81.43,61.52) v1(81.43,60.75) v1(81.54,104.22) v1(81.54,103.45) v1(81.54,58.54) v1(81.54,57.77) v1(82.54,106.89) v1(82.54,106.12) v1(82.61,104.27) v1(82.61,103.5) v1(83.22,106.89) v1(83.22,106.12) v1(83.29,104.27) v1(83.29,103.5) v1(84.49,106.89) v1(84.49,106.12) v1(84.59,104.24) v1(84.59,103.47) v1(85.17,106.89) v1(85.17,106.12) v1(85.27,104.24) v1(85.27,103.47) v1(88.51,61) v1(89.72,103.4) v1(89.82,26.6) v1(89.82,25.83) v1(89.84,24.5) v1(89.84,23.73) v1(90,58.63) v1(90.06,106.96) v1(90.06,106.19) v1(90.4,104.17) v1(90.4,103.4) v1(90.5,26.6) v1(90.5,25.83) v1(90.52,24.5) v1(90.52,23.73) v1(90.63,63.43) v1(92.18,31.93) v1(92.18,31.16) v1(92.39,26.47) v1(92.39,25.7) v1(92.42,24.43) v1(92.42,23.66) v1(92.86,31.93) v1(92.86,31.16) v1(93.07,26.47) v1(93.07,25.7) v1(93.1,24.43) v1(93.1,23.66) v1(94.01,32.04) v1(94.01,31.27) v1(94.07,34.17) v1(94.07,33.4) v1(94.13,30.24) v1(94.13,29.47) v1(94.69,32.04) v1(94.69,31.27) v1(94.75,34.17) v1(94.75,33.4) v1(94.81,30.24) v1(94.81,29.47) v1(95.17,63.02) v1(95.17,62.25) v1(95.85,63.02) v1(95.85,62.25)
595DS: length 45.9
  Top Layer w0.152: U28.75 37.68,75.75 v1(37.69,75.76) ; v1(39.64,75.75) 59.28,75.75 59.89,76.36 59.89,87.6 59.45,88.04 52.2,88.04 U19.14
  Bottom Layer w0.152: v1(39.64,75.75) 39.63,75.76 v1(37.69,75.76)
595SHCP: length 46.9
  Top Layer w0.152: U28.70 30.94,83.12 31.93,82.13 v1(38.25,82.13) ; U19.11 52.14,84.17 58.48,84.17 58.88,83.77 58.88,77.48 58.45,77.05 40.73,77.05 40.48,77.3 v1(40.48,82.11)
  Bottom Layer w0.152: v1(40.48,82.11) 38.27,82.11 v1(38.25,82.13)
595STCP: length 48.4
  Top Layer w0.152: U19.12 59.12,85.44 59.38,85.18 59.38,76.9 58.96,76.48 39.99,76.48 39.73,76.74 v1(39.73,83.36) ; v1(38.23,83.38) 38.22,83.37 U28.69
  Bottom Layer w0.152: v1(39.73,83.36) 38.25,83.36 v1(38.23,83.38)
BEEP: length 43.3
  Top Layer w0.152: v1(35.9,48.73) 35.9,32.11 R41.2 ; U28.77 35.28,73.21 35.89,72.6 35.89,54.27 v1(35.9,54.26)
  Bottom Layer w0.152: v1(35.9,48.73) v1(35.9,54.26)
EN: length 8.8
  Top Layer w0.152: U1.5 73.61,35.15 73.69,35.07 77.45,35.07 77.77,35.39 R63.1 77.77,39.2 R64.2
FB: length 8.9
  Top Layer w0.3: C13.1 73.46,41.46 R61.1 ; 73.54,39.26 75.62,39.26 R62.2 75.71,36.72 75.64,36.65 74.77,36.65 74.56,36.44 U1.4
KEY1: length 76.4
  Top Layer w0.152: KEY1.4 39.06,38.74 39.06,48.9 39.71,49.55 63.01,49.55 63.66,50.2 v1(63.66,76.19) ; U28.16 66.44,88.59 64.13,88.59 63.67,88.13 v1(63.67,80.13)
  Bottom Layer w0.152: v1(63.67,80.13) 63.67,76.2 v1(63.66,76.19)
KEY2: length 96.8
  Top Layer w0.152: KEY2.4 49.39,38.69 R55.2 49.35,41.78 49.35,47.99 49.77,48.41 74.83,48.41 75.32,48.9 75.32,103.68 75.23,103.77 U28.27
KEY3: length 111.8
  Top Layer w0.152: 74.86,61.03 74.86,49.29 74.49,48.92 47.91,48.92 47.32,48.33 47.32,31.72 48.09,30.95 49.38,30.95 R56.2 49.39,27.8 KEY3.4 ; 74.86,61.03 74.86,61.09 ; 74.86,61.03 74.85,61.04 74.85,101.75 74.02,102.58 67.69,102.58 U28.28
KEY4: length 132.1
  Top Layer w0.152: v1(37.37,52.02) 60.17,52.02 60.52,52.37 v1(60.52,104.28) ; v1(60.52,108.76) 60.51,108.77 U28.49 ; KEY4.4 39.05,27.84 R57.2 38.25,30.96 37.37,31.84 v1(37.37,49.26)
  Bottom Layer w0.152: v1(37.37,49.26) v1(37.37,52.02) ; v1(60.52,108.76) v1(60.52,104.28)
M1_E1: length 51.4
  Top Layer w0.152: U29.3 78.16,105.18 77.64,104.66 v1(77.64,98.24) ; v1(72.42,98.24) 72.42,79.91 72.18,79.67 67.8,79.67 U28.8
  Bottom Layer w0.152: v1(77.64,98.24) v1(72.42,98.24)
M1_E2: length 51.6
  Top Layer w0.152: U28.10 67.78,82.19 71.66,82.19 71.81,82.34 71.81,98.87 v1(71.85,98.91) ; v1(76.88,98.89) 76.88,107.32 77.28,107.72 92.29,107.72 U29.4
  Bottom Layer w0.152: v1(71.85,98.91) 76.24,98.91 76.26,98.89 v1(76.88,98.89)
M1_IN1: length 67.1
  Top Layer w0.152: v1(59.88,97.35) 59.88,89.61 59.52,89.25 U19.15 ; U3.14 97.8,87.55 98.45,88.2 98.45,96.36 97.39,97.42 v1(77.03,97.42)
  Bottom Layer w0.152: 66.93,97.42 59.95,97.42 v1(59.88,97.35) ; 66.94,97.42 v1(77.03,97.42)
M1_IN2: length 64.9
  Top Layer w0.152: 76.88,96.29 v1(76.87,96.28) 76.88,96.28 ; 76.88,96.29 76.88,96.29 ; 76.88,96.29 96.5,96.29 97.81,94.98 97.81,90.64 97.21,90.04 94.45,90.04 U3.15 ; U19.1 50.43,90.52 50.62,90.71 50.62,94.48 50.97,94.83 59.21,94.83 v1(59.22,94.84)
  Bottom Layer w0.152: v1(76.87,96.28) 70.97,96.28 70.82,96.13 70.82,95.1 70.56,94.84 v1(59.22,94.84)
M1_O1: length 28.5
  Top Layer w0.762: U3.4 88.27,85.01 v4(88.3,84.98)
  Bottom Layer w0.762: v4(88.3,84.98) 88.33,85.01 88.33,99.18 ; 88.34,99.2 89.29,100.15 92.3,100.15 U29.1
M1_O2: length 43.2
  Top Layer w0.762: v4(86.78,82.81) 86.44,82.47 U3.5
  Bottom Layer w0.762: 86.77,108.62 86.76,108.63 ; 86.77,108.62 86.78,108.61 v4(86.78,82.81) ; 86.77,108.62 86.77,110.16 ; U29.6 88.11,112.68 86.79,111.36 86.79,110.18 86.77,110.16 ; 86.77,110.18 86.77,110.16
M1_PWM: length 49.6
  Top Layer w0.152: U28.3 72.84,73.29 73.15,73.6 73.15,95.28 v1(73.13,95.3) ; U3.16 94.38,92.65 94.38,94.75 93.83,95.3 v1(77.2,95.3)
  Bottom Layer w0.152: v1(77.2,95.3) v1(73.13,95.3)
M2_E1: length 64.6
  Top Layer w0.152: v1(76.96,59.8) 92.31,59.8 U30.3 ; v1(74.27,59.79) 74.27,100.99 74.03,101.23 U28.25
  Bottom Layer w0.152: v1(74.27,59.79) 76.95,59.79 v1(76.96,59.8)
M2_E2: length 64
  Top Layer w0.152: U28.26 67.76,99.97 73.57,99.97 73.72,99.82 73.72,62.33 v1(73.7,62.31) ; v1(77,62.29) U30.4
  Bottom Layer w0.152: v1(73.7,62.31) 76.98,62.31 v1(77,62.29)
M2_IN1: length 88.2
  Top Layer w0.152: U19.2 50.12,89.25 50.31,89.06 v1(50.31,78.93) ; v1(76.94,68.83) 76.92,68.85 76.92,71.06 77.29,71.43 97.89,71.43 98.47,72.01 98.47,82.15 98.15,82.47 U3.12
  Bottom Layer w0.152: 50.86,71.54 64.72,71.54 65,71.26 65,69.45 65.61,68.84 76.93,68.84 v1(76.94,68.83) ; v1(50.31,78.93) 50.31,72.11 50.86,71.56
M2_IN2: length 76.2
  Top Layer w0.152: v1(51.13,78.04) 51.12,78.05 50.23,78.05 49.77,78.53 49.76,78.54 49.76,87.71 49.49,87.98 U19.3 ; v1(77.46,72.09) 97.17,72.09 97.43,72.35 97.43,79.3 96.81,79.92 94.41,79.92 U3.11
  Bottom Layer w0.152: 77.17,72.09 77.17,72.09 51.72,72.09 51.13,72.68 v1(51.13,78.04) ; 77.18,72.09 v1(77.46,72.09)
M2_O1: length 38.5
  Top Layer w0.762: U3.6 86.85,79.93 v4(86.86,79.94) ; v4(86.92,58.34) 86.92,55.77 87.89,54.8 92.31,54.8 U30.1
  Bottom Layer w0.762: v4(86.86,79.94) 86.86,58.4 v4(86.92,58.34)
M2_O2: length 23.7
  Top Layer w0.762: U30.6 92.24,67.37 89.32,67.37 88.91,67.78 v4(88.91,69.61) ; v4(88.82,77.41) 88.8,77.39 U3.7
  Bottom Layer w0.762: v4(88.82,77.41) 88.82,69.7 v4(88.91,69.61)
M2_PWM: length 37.6
  Top Layer w0.152: U28.5 v1(72.61,75.83) ; v1(76.8,72.63) 96.46,72.63 96.87,73.04 96.87,76.83 96.38,77.32 94.47,77.32 U3.10
  Bottom Layer w0.152: v1(76.8,72.63) 76.78,72.65 72.81,72.65 72.61,72.85 v1(72.61,75.83)
M3_E1: length 55.9
  Top Layer w0.152: U28.63 32.6,90.99 31.31,92.28 23.31,92.28 22.91,91.88 22.91,62.64 22.59,62.32 7.65,62.32 U31.3
M3_E2: length 51.3
  Top Layer w0.152: 23.5,88.08 23.5,60.6 22.69,59.79 U31.4 ; U28.66 23.88,88.45 23.51,88.08
M3_IN1: length 26.5
  Top Layer w0.152: U19.4 40.33,86.71 v1(40.31,86.73)
  Bottom Layer w0.152: U4.14 20.81,87.24 35.53,87.24 35.95,86.82 40.22,86.82 v1(40.31,86.73)
M3_IN2: length 33.6
  Top Layer w0.152: v1(39.72,87.35) 48.03,87.35 48.43,86.95 48.43,85.58 48.29,85.44 U19.5
  Bottom Layer w0.152: U4.15 20.78,89.81 39.2,89.81 39.72,89.29 v1(39.72,87.35)
M3_O1: length 34
  Top Layer w0.762: U4.4 13.86,85.01 14.62,84.25 14.62,68.04 13.86,67.28 7.63,67.28 U31.1
M3_O2: length 40.9
  Top Layer w0.762: v4(13.1,56.58) 13.1,55.5 12.37,54.77 7.64,54.77 U31.6 ; v4(13.06,69.07) 13.05,69.08 13.05,81.71 12.29,82.47 U4.5
  Bottom Layer w0.762: v4(13.1,56.58) 13.06,56.62 v4(13.06,69.07)
M3_PWM: length 26.5
  Top Layer w0.152: U4.16 20.55,92.68 v1(20.55,104.11) ; v1(20.52,108.61) 20.68,108.77 U28.50
  Bottom Layer w0.152: v1(20.52,108.61) 20.52,104.14 v1(20.55,104.11)
M4_E1: length 62
  Top Layer w0.152: U32.3 7.79,107.51 67.7,107.51 U28.31
M4_E2: length 72.6
  Top Layer w0.152: v1(64.69,104.87) 7.93,104.87 U32.4 ; v1(64.7,102.79) 64.71,102.78 64.71,91.41 65.05,91.07 U28.18
  Bottom Layer w0.152: v1(64.7,102.79) 64.7,104.86 v1(64.69,104.87)
M4_IN1: length 28
  Top Layer w0.152: U19.6 41.33,84.17 v1(40.8,84.7)
  Bottom Layer w0.152: v1(40.8,84.7) 23.76,84.7 23.2,84.14 23.2,83.02 22.74,82.56 20.59,82.56 U4.12
M4_IN2: length 30
  Top Layer w0.152: v1(40.24,84.11) 40.27,84.11 41.48,82.9 U19.7
  Bottom Layer w0.152: 39.83,84.1 39.83,84.1 ; 39.83,84.1 35.33,84.11 35.03,83.81 35.03,82.44 34.7,82.11 23.81,82.11 ; 39.83,84.1 40.23,84.1 v1(40.24,84.11) ; U4.11 20.53,79.96 22.91,79.96 23.21,80.26 23.21,81.58 23.72,82.09 23.8,82.09
M4_O1: length 43.3
  Top Layer w0.762: v4(11.54,79.96) 11.51,79.93 U4.6
  Bottom Layer w0.762: U32.1 7.63,112.69 10.79,112.69 11.54,111.94 v4(11.54,79.96)
M4_O2: length 30.5
  Top Layer w0.762: v4(9.83,77.16) 4.73,77.16 U4.7
  Bottom Layer w0.762: 9.83,98.32 9.81,99.71 9.32,100.2 7.64,100.2 U32.6 ; 9.83,98.32 v4(9.83,77.16) ; 9.83,98.32 9.83,98.42 9.85,98.44
M4_PWM: length 13.6
  Top Layer w0.152: U28.72 25.63,80.83 25.34,80.54 v1(25.34,77.51)
  Bottom Layer w0.152: v1(25.34,77.51) 20.62,77.51 U4.10
OLED_CS: length 70.7
  Top Layer w0.152: v1(26.75,49.13) 26.75,29.47 27.24,28.98 28.25,28.98 28.65,28.58 28.65,26.06 U11.7 ; U28.71 37.26,80.83 38.39,79.7 38.39,55.36 35.87,52.84 v1(26.74,52.84)
  Bottom Layer w0.152: v1(26.75,49.13) 26.75,49.63 26.74,49.64 v1(26.74,52.84)
OLED_DC: length 79.2
  Top Layer w0.152: v1(25.49,48.48) 25.49,29.1 26.18,28.41 26.18,26.03 U11.6 ; U28.65 37.31,88.45 38.94,86.82 38.94,54.65 36.47,52.18 v1(25.49,52.18)
  Bottom Layer w0.152: v1(25.49,52.18) v1(25.49,48.48)
OLED_RST: length 105.2
  Top Layer w0.152: v1(63.07,75.57) 63.07,50.69 62.4,50.02 25.74,50.02 23.62,47.9 23.62,26.01 U11.5 ; U28.13 67.83,87.2 64.73,87.2 64.41,86.88 64.41,79.26 64.2,79.05 63.06,79.05 v1(63.05,79.06)
  Bottom Layer w0.152: v1(63.05,79.06) 63.05,75.59 v1(63.07,75.57)
OLED_SCL: length 70.8
  Top Layer w0.152: U28.68 24.69,85.91 24.39,85.61 24.39,53.66 23.47,52.74 19.85,52.74 18.58,51.47 v1(18.58,39.11) ; v1(18.58,34.33) 18.56,34.31 18.56,26.02 U11.3
  Bottom Layer w0.152: v1(18.58,39.11) v1(18.58,34.33)
OLED_SDA: length 106.1
  Top Layer w0.152: U11.4 21.04,26.06 21.04,49.57 22.12,50.65 61.81,50.65 62.32,51.16 v1(62.32,74.96) 62.31,74.95 62.31,74.95 ; v1(62.32,78.15) 62.33,78.14 64.72,78.14 64.91,78.33 64.91,84.47 65.14,84.7 67.79,84.7 U28.11
  Bottom Layer w0.152: v1(62.32,78.15) v1(62.32,74.96)
RX1: length 38.3
  Top Layer w0.152: U28.17 70.38,91.07 70.6,91.29 v1(70.6,99.03) ; v1(70.62,107.31) 70.62,115.06 71.15,115.59 83.19,115.59 U21.3
  Bottom Layer w0.152: v1(70.62,107.31) 70.6,107.29 v1(70.6,99.03)
SCL1: length 93
  Top Layer w0.152: 88.44,42.99 76.69,42.99 76.2,43.47 76.2,105.8 75.69,106.31 U28.29 ; U18.3 95.98,44.34 R7.2 92.35,44.33 92.35,43.11 92.23,42.99 91.48,42.99 arc(90.94,43.21) 90.72,43.75 90.72,43.8 arc(89.96,44.56) 89.19,43.8 arc(88.96,43.23) 88.39,42.99
SCL2: length 106.2
  Top Layer w0.152: U28.7 67.82,77.15 61.72,77.15 61.52,76.95 61.52,51.74 61.13,51.35 20.94,51.35 20.09,50.5 20.09,37.68 19.82,37.41 R9.2 2.18,37.41 H1.5
SDA1: length 92.9
  Top Layer w0.152: U18.4 96.07,41.69 R8.2 92.31,42.45 92.08,42.68 76.25,42.68 75.84,43.09 75.84,104.74 75.44,105.14 70.68,105.14 70.67,105.13 68.55,105.13 68.54,105.14 67.67,105.14 U28.30
SDA2: length 65.8
  Top Layer w0.152: 6.36,34.93 6.21,34.78 5.28,34.78 ; 5.28,34.78 5.23,34.83 H1.6 ; 5.28,34.78 5.1,34.78 R10.2 ; v1(19.41,36.71) 6.75,36.71 6.36,36.32 6.36,34.94 ; 19.42,38.24 19.42,51.32 20.3,52.2 24.35,52.2 25.16,53.01 25.16,72.64 25.73,73.21 U28.78 ; 5.14,34.65 5.13,34.66
  Bottom Layer w0.152: v1(19.41,36.71) 19.4,36.72 v1(19.4,38.24)
SW:
  vias: v1(68.33,33.8) v1(68.33,33.08) v1(68.37,32.4) v1(69.03,33.79) v1(69.06,33.09) v1(69.09,32.42) v1(71.86,25.19) v1(71.96,24.52) v1(71.99,23.69) v1(72.86,25.19) v1(72.89,24.52) v1(72.98,23.75) v1(73.8,25.22) v1(73.9,30.08) v1(73.9,29.3) v1(73.9,28.53) v1(73.86,24.5) v1(73.86,23.74) v1(74.62,25.25) v1(74.73,30.08) v1(74.73,29.29) v1(74.73,28.62) v1(74.68,24.49) v1(74.67,23.68) v1(75.43,25.25) v1(75.43,24.49) v1(75.45,23.7) v1(75.57,30.08) v1(75.57,29.34) v1(75.57,28.6)
TX1: length 38.1
  Top Layer w0.152: U21.2 72.06,113.06 71.26,112.26 v1(71.26,107.73) ; v1(71.25,99.39) 71.25,88.72 71.06,88.53 U28.15
  Bottom Layer w0.152: v1(71.25,99.39) 71.25,107.72 v1(71.26,107.73)
$1N2097: length 6.3
  Top Layer w0.3: U27.3 C6.2 63,31.7 62.35,31.05 62.35,28.94 F2.2
$1N3300: length 3
  Top Layer w0.152: R1.1 U3.13
$1N3306: length 2.8
  Top Layer w0.152: R2.1 20.42,84.93 U4.13
$1N3954: length 2.5
  Top Layer w0.152: U19.9 53.7,81.63 R3.1
$1N3999: length 2.3
  Top Layer w0.152: R4.1 54.08,82.9 U19.10
$1N4038: length 2.2
  Top Layer w0.152: U19.13 54.31,86.71 R5.1
$1N7178: length 3.4
  Top Layer w0.152: R41.1 34.3,30.28 R46.2 34.32,30.24 Q1.1
$1N14720: length 3.7
  Top Layer w0.152: BUZZER3.1 30.69,44.38 R45.2
$1N14723: length 4.5
  Top Layer w0.152: Q1.3 30.69,31.2 BUZZER3.2
$1N15095: length 1.9
  Top Layer w0.152: R59.1 59.08,45.81 57.25,45.81
$1N22679: length 4.7
  Top Layer w0.5: C10.2 70.39,35.44 70.39,36.77 70.63,37.01 72.35,37.01 72.66,36.7 U1.6
$1N22686: length 4.9
  Top Layer w0.3: R61.2 71.46,41.46 C13.2 71.41,41.43 R60.1
$1N22696: length 2.5
  Top Layer w0.152: R6.1 64.35,23.75 LED1.2

## Copper pours and planes (outline as drawn; the poured copper is in the pictures)
5V on Top Layer: 63.67,30.01 71.04,30.01 71.04,23.4 63.67,23.4
12V on Top Layer: 76.59,35.46 88.5,35.46 88.5,28.32 76.59,28.32
GND on Top Layer: 67.73,33.8 88.51,33.8 88.51,26.19 67.73,26.19
GND on Top Layer: -4.13,124.71 106.48,124.71 106.48,12.84 -4.13,12.84
GND on Bottom Layer: -3.38,123.96 106.48,123.96 106.48,16.35 -3.38,16.35
DC12V on Top Layer: 85.31,38.32 94.55,38.32 94.55,35.82 85.31,35.82
SW on Top Layer: 67.96,34.14 71.37,34.14 71.37,31.82 67.96,31.82
SW on Top Layer: 69.34,27.91 76.17,27.91 76.17,23.38 69.34,23.38
SW on Top Layer: 73.34,33.81 76.14,33.81 76.14,28.3 73.34,28.3
SW on Bottom Layer: 67.94,34.15 76.15,34.15 76.15,27.96 67.94,27.96
SW on Bottom Layer: 71.38,30.68 76.19,30.68 76.19,23.38 71.38,23.38
$1N22948 on Top Layer: 74.27,34.72 78.76,34.72 78.76,31.4 74.27,31.4

Small or netless copper shapes (teardrops, artwork), in the pictures only: 325 on Top Layer, 139 on Bottom Layer

## Text on the board
Top Silkscreen Layer: GND | 3.3v | SCL2 | SDA2 | RST | DC | CS | SCL3 | SDA3 | M3_E1 | M4_E2 | 5V | M4_02 | M4_01 | M4_E1 | M3_E2 | RX | TX | SDA1 | SCL1 | M1_E1 | M1-01 | M1_02 | M2_E2 | M1-02 | M1_01 | M2_E1 | M1_E2 | M3_01 | M3_02 | 3.3V | L1 | L2 | 开关 | 左后 | 左前 | OLED屏幕 | 蜂鸣器 | 右后 | 12V座子 | 右前
